# Altium schematic sheet Current Sensor Interface.SchDoc
size OrCAD A
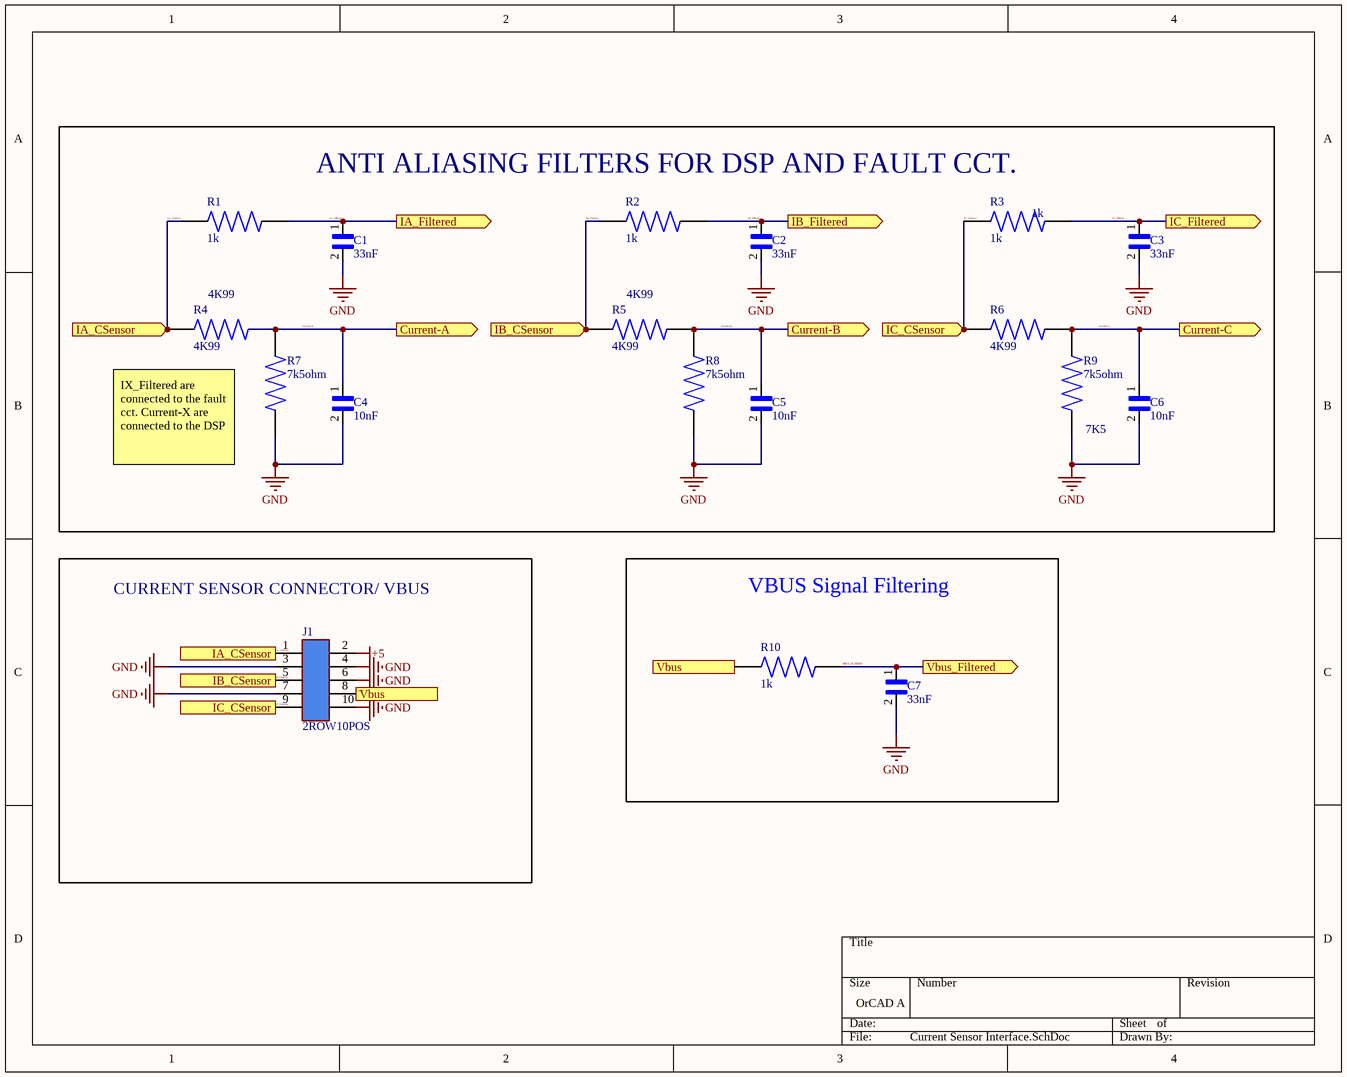
[diagram p0: Current Sensor Interface.SchDoc]

## Parts
C1  33nF  [CAP 0805(2012 metric)]
C2  33nF  [CAP 0805(2012 metric)]
C3  33nF  [CAP 0805(2012 metric)]
C4  10nF  [CAP 0805(2012 metric)]
C5  10nF  [CAP 0805(2012 metric)]
C6  10nF  [CAP 0805(2012 metric)]
C7  33nF  [CAP 0805(2012 metric)]
J1  2ROW10POS  [2ROW10POS]
R1  1k  [RES 0805(2012 metric)]
R2  1k  [RES 0805(2012 metric)]
R3  1k  [RES 0805(2012 metric)]
R4  4K99  [RES 0805(2012 metric)]
R5  4K99  [RES 0805(2012 metric)]
R6  4K99  [RES 0805(2012 metric)]
R7  7k5ohm  [RES 0805(2012 metric)]
R8  7k5ohm  [RES 0805(2012 metric)]
R9  7k5ohm  [RES 0805(2012 metric)]
R10  1k  [RES 0805(2012 metric)]

## Blocks framed on the sheet
ANTI ALIASING FILTERS FOR DSP AND FAULT CCT.: C1-C6 R1-R9
CURRENT SENSOR CONNECTOR/ VBUS: J1
VBUS Signal Filtering: C7 R10

## Ports
Current-A (out), Current-B (out), Current-C (out), IA_CSensor (in), IA_CSensor (out), IA_Filtered (out), IB_CSensor (in), IB_CSensor (out), IB_Filtered (out), IC_CSensor (in), IC_CSensor (out), IC_Filtered (out), Vbus (in), Vbus (out), Vbus_Filtered (out)

## Nets
+5: J1.2
GND: C1.2 C2.2 C3.2 C4.2 C5.2 C6.2 C7.2 J1.3 J1.4 J1.6 J1.7 J1.10 R7.1 R8.1 R9.1
Current-A: C4.1 R4.2 R7.2 ; port Current-A
Current-B: C5.1 R5.2 R8.2 ; port Current-B
Current-C: C6.1 R6.2 R9.2 ; port Current-C
IA_CSensor: J1.1 R1.1 R4.1 ; port IA_CSensor
IA_Filtered: C1.1 R1.2 ; port IA_Filtered
IB_CSensor: J1.5 R2.1 R5.1 ; port IB_CSensor
IB_Filtered: C2.1 R2.2 ; port IB_Filtered
IC_CSensor: J1.9 R3.1 R6.1 ; port IC_CSensor
IC_Filtered: C3.1 R3.2 ; port IC_Filtered
VBUS: J1.8 R10.1 ; port Vbus
VBUS_FILTERED: C7.1 R10.2 ; port Vbus_Filtered

## Notes on the sheet
- (near R3) 1k
- (near R4) 4K99
- (near R5) 4K99
- IX_Filtered are connected to the fault cct. Current-X are connected to the DSP
- (near R9) 7K5

## Library data of the parts
C1-C3 C7 = 33nF: 0.033µF ±10% 100V Ceramic Capacitor X7R 0805 (2012 Metric)
C4-C6 = 10nF: 10000pF ±10% 25V Ceramic Capacitor X7R 0805 (2012 Metric)
R1-R3 R10 = 1k: Resistor 0805 1k ohm 0.1W